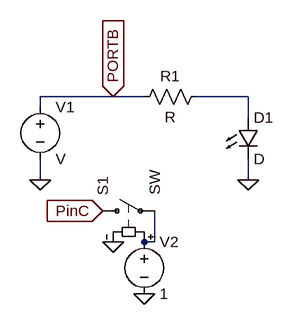
[diagram p0: schematic LEDSchematic.asc]
LEDSchematic.asc, the LTspice schematic file:
Version 4
SHEET 1 880 680
WIRE -80 288 -192 288
WIRE -32 288 -80 288
WIRE 128 288 48 288
WIRE -192 304 -192 288
WIRE 128 320 128 288
WIRE -192 416 -192 384
WIRE 128 416 128 384
WIRE -16 512 -16 464
WIRE -16 512 -32 512
FLAG -192 416 0
FLAG 128 416 0
FLAG -80 288 PORTB
IOPIN -80 288 In
FLAG -96 464 PinC
IOPIN -96 464 In
FLAG -80 512 0
FLAG -32 592 0
SYMBOL voltage -192 288 R0
SYMATTR InstName V1
SYMBOL res 64 272 R90
WINDOW 0 0 56 VBottom 2
WINDOW 3 32 56 VTop 2
SYMATTR InstName R1
SYMBOL LED 112 320 R0
SYMATTR InstName D1
SYMBOL sw -112 464 R270
SYMATTR InstName S1
SYMBOL voltage -32 496 R0
WINDOW 123 0 0 Left 0
WINDOW 39 0 0 Left 0
SYMATTR InstName V2
SYMATTR Value 1

The netlist it stands for:
* LEDSchematic.asc
V1 PORTB 0 V
R1 N001 PORTB R
D1 N001 0 D
S1 PinC N002 N002 0 SW
V2 N002 0 1
.model D D
.lib standard.dio
.backanno
.end